# Altium project ADS1282.PrjPcb
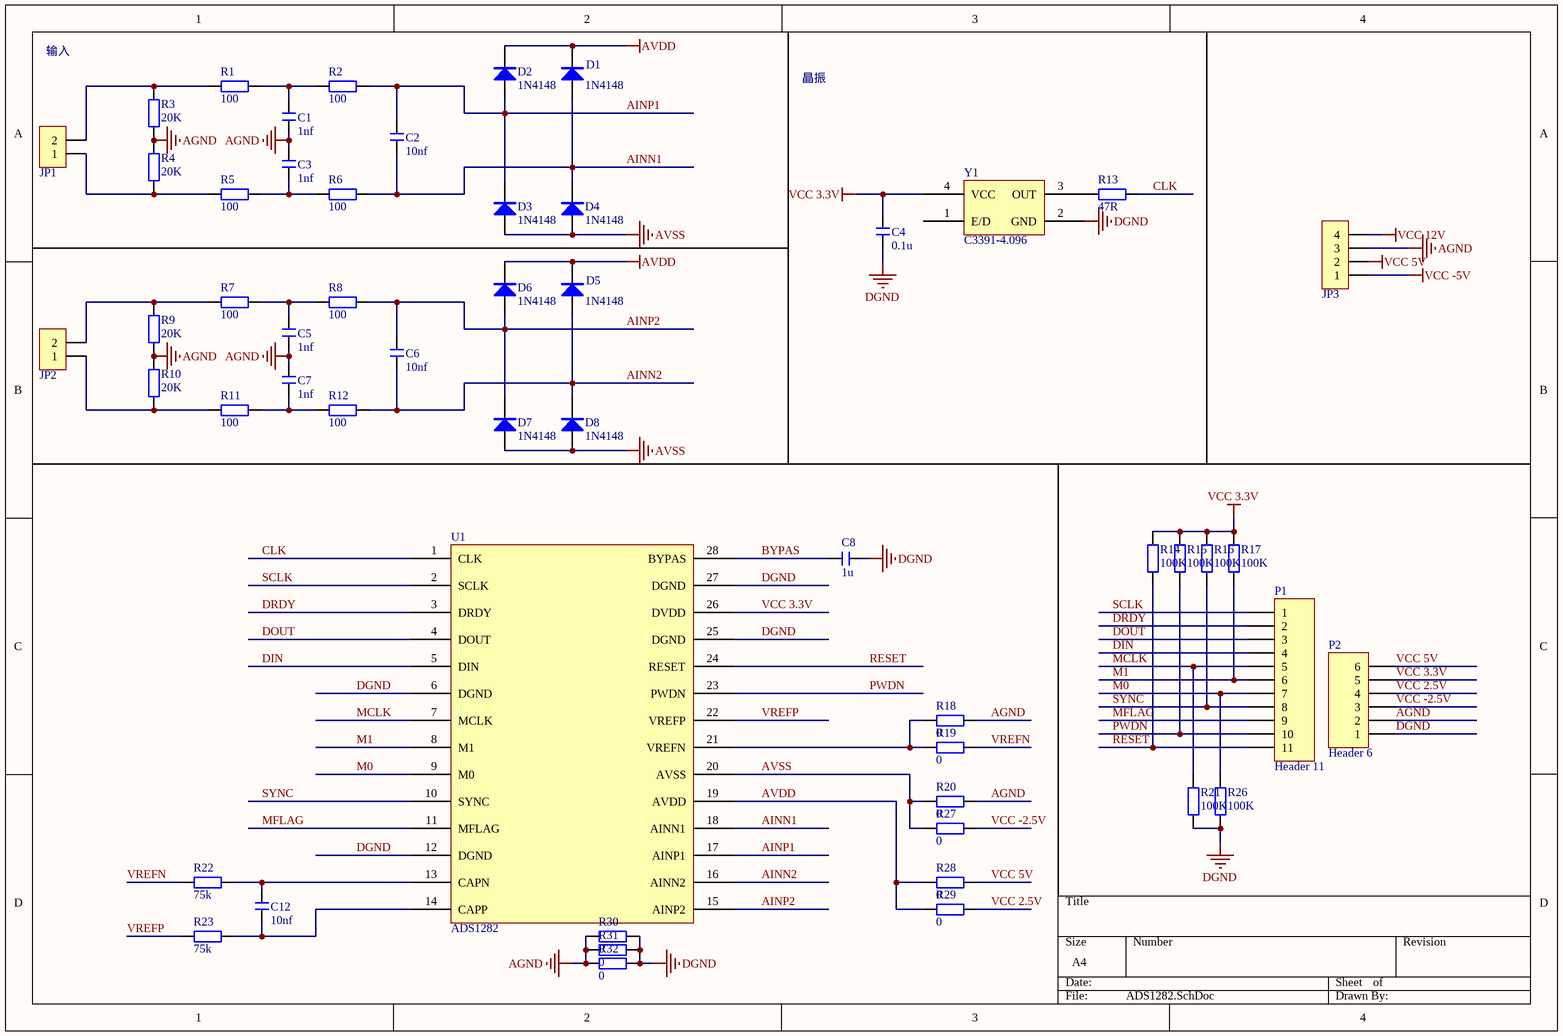
[diagram p0: ADS1282.SchDoc]
2 sheets, 88 parts. Net scope: global (net labels, ports and power ports of the same name join across sheets).
Board file: ADS1282.PcbDoc
Sheets:
  ADS1282.SchDoc
  电源.SchDoc

## Sheet ADS1282.SchDoc
size A4

### Parts
C1  1nf  [C 0805_L]
C2  10nf  [C 0805_L]
C3  1nf  [C 0805_L]
C4  0.1u  [C 0805_L]
C5  1nf  [C 0805_L]
C6  10nf  [C 0805_L]
C7  1nf  [C 0805_L]
C8  1u  [C 0805_L]
C12  10nf  [C 0805_L]
D1  1N4148  [SOD-523]
D2  1N4148  [SOD-523]
D3  1N4148  [SOD-523]
D4  1N4148  [SOD-523]
D5  1N4148  [SOD-523]
D6  1N4148  [SOD-523]
D7  1N4148  [SOD-523]
D8  1N4148  [SOD-523]
JP1  HDR-1X2  [KF2EDGK5.08-LI-2P]  (value not drawn)
JP2  HDR-1X2  [KF2EDGK5.08-LI-2P]  (value not drawn)
JP3  HDR-1X4  [KF2EDGK5.08-LI-4P]  (value not drawn)
P1  Header 11  [HDR1X11]
P2  Header 6  [HDR1X6]
R1  100  [R 0805_L]
R2  100  [R 0805_L]
R3  20K  [R 0805_L]
R4  20K  [R 0805_L]
R5  100  [R 0805_L]
R6  100  [R 0805_L]
R7  100  [R 0805_L]
R8  100  [R 0805_L]
R9  20K  [R 0805_L]
R10  20K  [R 0805_L]
R11  100  [R 0805_L]
R12  100  [R 0805_L]
R13  47R  [R 0805_L]
R14  100K  [R 0805_L]
R15  100K  [R 0805_L]
R16  100K  [R 0805_L]
R17  100K  [R 0805_L]
R18  0  [R 0603_L]
R19  0  [R 0603_L]
R20  0  [R 0603_L]
R21  100K  [R 0805_L]
R22  75k  [R 0805_L]
R23  75k  [R 0805_L]
R26  100K  [R 0805_L]
R27  0  [R 0603_L]
R28  0  [R 0603_L]
R29  0  [R 0603_L]
R30  0  [R 0805_L]
R31  0  [R 0805_L]
R32  0  [R 0805_L]
U1  ADS1282  [SSOP28_N]
Y1  C3391-4.096  [OSC 3225-4P]

### Nets
AGND: C1.1 C3.2 C5.1 C7.2 JP3.3 P2.2 R3.1 R4.2 R9.1 R10.2 R18.2 R20.2 R30.1 R31.1 R32.1
AVDD: D1.2(K) D2.2(K) D5.2(K) D6.2(K) R28.1 R29.1 U1.19(AVDD)
AVSS: D3.1(A) D4.1(A) D7.1(A) D8.1(A) R20.1 R27.1 U1.20(AVSS)
DGND: C4.1 C8.2 P2.1 R21.1 R26.1 R30.2 R31.2 R32.2 U1.6(DGND) U1.12(DGND) U1.25(DGND) U1.27(DGND) Y1.2(GND)
VCC 2.5V: P2.4 R29.2
VCC 3.3V: C4.2 P2.5 R14.2 R15.2 R16.2 R17.2 U1.26(DVDD) Y1.4(VCC)
VCC 5V: JP3.2 P2.6 R28.2
VCC 12V: JP3.4
VCC -2.5V: P2.3 R27.2
VCC -5V: JP3.1
AINN1: C2.1 D1.1(A) D4.2(K) R6.2 U1.18(AINN1)
AINN2: C6.1 D5.1(A) D8.2(K) R12.2 U1.16(AINN2)
AINP1: C2.2 D2.1(A) D3.2(K) R2.2 U1.17(AINP1)
AINP2: C6.2 D6.1(A) D7.2(K) R8.2 U1.15(AINP2)
BYPAS: C8.1 U1.28(BYPAS)
CLK: R13.2 U1.1(CLK)
DIN: P1.4 U1.5(DIN)
DOUT: P1.3 U1.4(DOUT)
DRDY: P1.2 U1.3(DRDY)
M0: P1.7 R26.2 U1.9(M0)
M1: P1.6 R17.1 U1.8(M1)
MCLK: P1.5 R21.2 U1.7(MCLK)
MFLAG: P1.9 U1.11(MFLAG)
PWDN: P1.10 R15.1 U1.23(PWDN)
RESET: P1.11 R14.1 U1.24(RESET)
SCLK: P1.1 U1.2(SCLK)
SYNC: P1.8 R16.1 U1.10(SYNC)
VREFN: R19.2 R22.1
VREFP: R23.1 U1.22(VREFP)
NetC1_2: C1.2 R1.2 R2.1
NetC3_1: C3.1 R5.2 R6.1
NetC5_2: C5.2 R7.2 R8.1
NetC7_1: C7.1 R11.2 R12.1
NetC12_1: C12.1 R23.2 U1.14(CAPP)
NetC12_2: C12.2 R22.2 U1.13(CAPN)
NetJP1_1: JP1.1 R4.1 R5.1
NetJP1_2: JP1.2 R1.1 R3.2
NetJP2_1: JP2.1 R10.1 R11.1
NetJP2_2: JP2.2 R7.1 R9.2
NetR13_1: R13.1 Y1.3(OUT)
NetR18_1: R18.1 R19.1 U1.21(VREFN)

Not connected (* = marked no-connect by the designer): Y1 1(E/D)

### Notes on the sheet
- 输入
- 晶振

### Library data of the parts
C1-C8 C12 = C: 无极性贴片电容; 版权归属: 源创客; BOM名称: 无极性贴片电容; 学习资源: www.ooocke.com
D1-D8 = 1N4148: 高速开关二极管; 版权归属: 源创客; BOM名称: 高速开关二极管; 学习资源: www.ooocke.com
JP1 JP2 = Header 2: 2P接插件; 版权归属: 源创客; BOM名称: 2P接插件; 学习资源: www.ooocke.com
JP3 = Header 4: 4P接插件; 版权归属: 源创客; BOM名称: 4P接插件; 学习资源: www.ooocke.com
P1 = Header 11: Header, 11-Pin; LatestRevisionDate: 17-Jul-2002; LatestRevisionNote: Re-released for DXP Platform.; Publisher: Altium Limited
P2 = Header 6: Header, 6-Pin; LatestRevisionDate: 17-Jul-2002; LatestRevisionNote: Re-released for DXP Platform.; Publisher: Altium Limited
R1-R23 R26-R32 = R: 贴片电阻; 版权归属: 源创客; BOM名称: 贴片电阻; 学习资源: www.ooocke.com
Y1 = 4.096M

## Sheet 电源.SchDoc
size A4
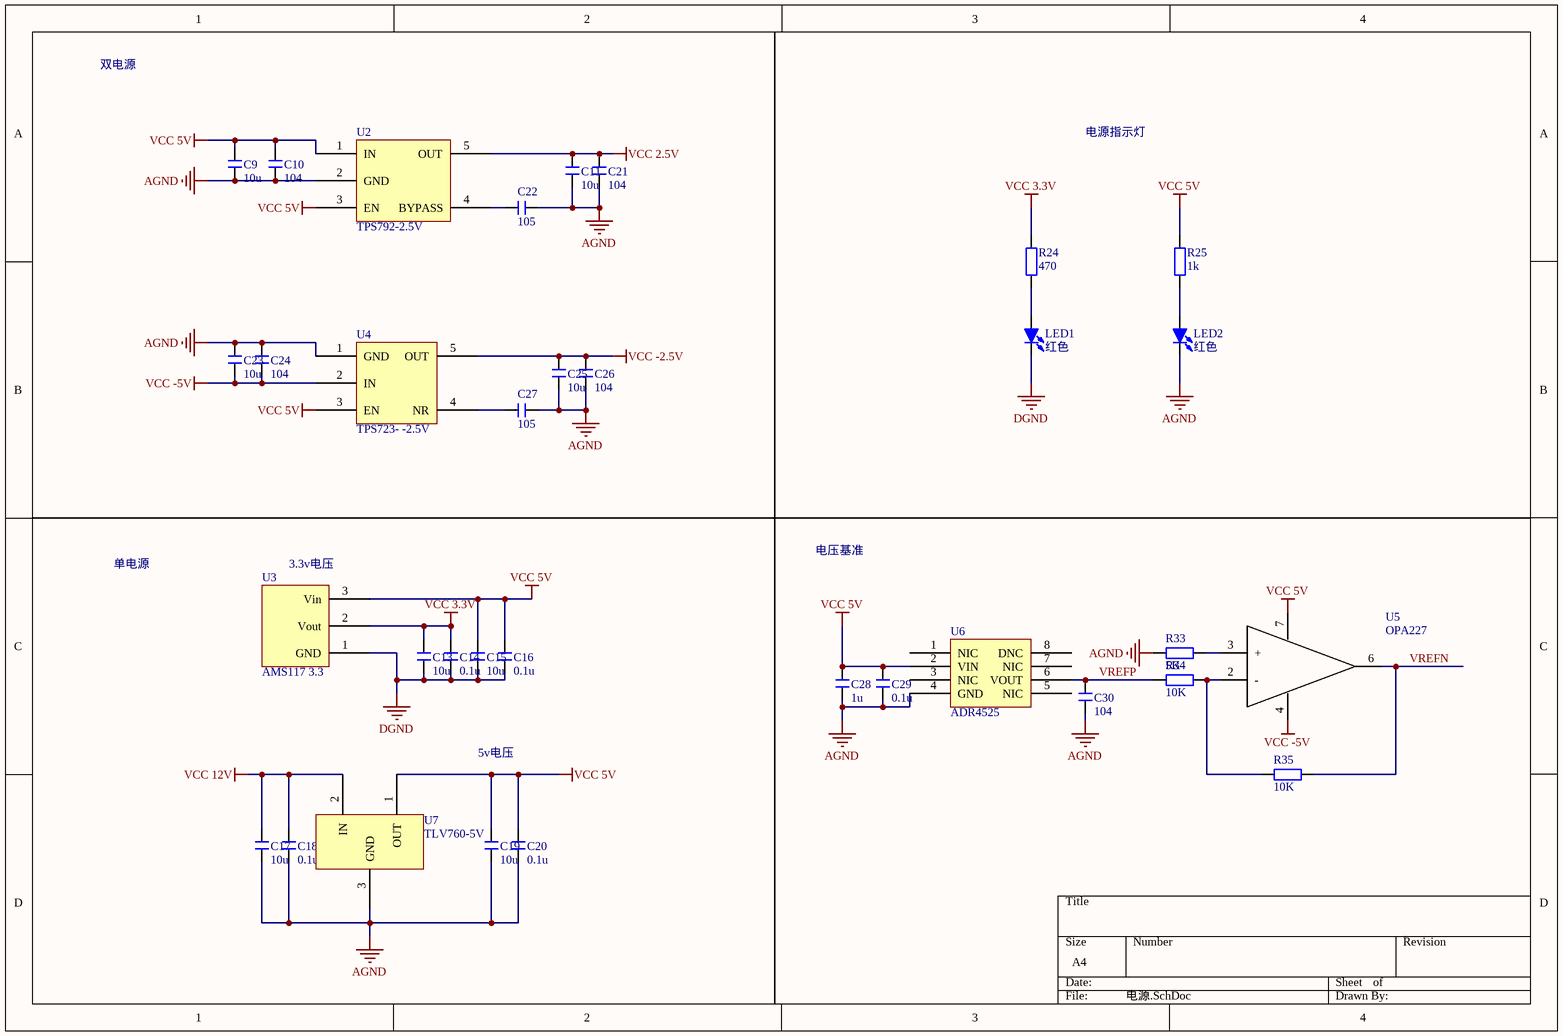
[diagram p1: 电源.SchDoc]

### Parts
C9  10u  [C 0805_L]
C10  104  [C 0805_L]
C11  10u  [C 0805_L]
C13  10u  [C 0805_L]
C14  0.1u  [C 0805_L]
C15  10u  [C 0805_L]
C16  0.1u  [C 0805_L]
C17  10u  [C 0805_L]
C18  0.1u  [C 0805_L]
C19  10u  [C 0805_L]
C20  0.1u  [C 0805_L]
C21  104  [C 0805_L]
C22  105  [C 0805_L]
C23  10u  [C 0805_L]
C24  104  [C 0805_L]
C25  10u  [C 0805_L]
C26  104  [C 0805_L]
C27  105  [C 0805_L]
C28  1u  [C 0805_L]
C29  0.1u  [C 0805_L]
C30  104  [C 0805_L]
LED1  红色  [LED 0805G]
LED2  红色  [LED 0805G]
R24  470  [R 0805_L]
R25  1k  [R 0805_L]
R33  5K  [R 0805_L]
R34  10K  [R 0805_L]
R35  10K  [R 0805_L]
U2  TPS792-2.5V  [SOT23-5N]
U3  AMS117 3.3  [SOT223_N]
U4  TPS723- -2.5V  [SOT23-5N]
U5  OPA227  [SOP8_N]
U6  ADR4525  [SOP8_N]
U7  TLV760-5V  [SOT23-3N]

### Nets
AGND: C9.1 C10.1 C11.1 C17.1 C18.1 C19.1 C20.1 C21.1 C22.2 C23.2 C24.2 C25.1 C26.1 C27.2 C28.1 C29.1 C30.1 LED2.2(K) R33.2 U2.2(GND) U4.1(GND) U6.4(GND) U7.3(GND)
DGND: C13.1 C14.1 C15.1 C16.1 LED1.2(K) U3.1(GND)
VCC 2.5V: C11.2 C21.2 U2.5(OUT)
VCC 3.3V: C13.2 C14.2 R24.2 U3.2(Vout)
VCC 5V: C9.2 C10.2 C15.2 C16.2 C19.2 C20.2 C28.2 C29.2 R25.2 U2.1(IN) U2.3(EN) U3.3(Vin) U4.3(EN) U5.7(VCC) U6.2(VIN) U7.1(OUT)
VCC 12V: C17.2 C18.2 U7.2(IN)
VCC -2.5V: C25.2 C26.2 U4.5(OUT)
VCC -5V: C23.1 C24.1 U4.2(IN) U5.4(VSS)
VREFN: R35.2 U5.6(UOT)
VREFP: C30.2 R34.1 U6.6(VOUT)
NetC22_1: C22.1 U2.4(BYPASS)
NetC27_1: C27.1 U4.4(NR)
NetLED1_1: LED1.1(A) R24.1
NetLED2_1: LED2.1(A) R25.1
NetR33_1: R33.1 U5.3(+)
NetR34_2: R34.2 R35.1 U5.2(-)

Not connected (* = marked no-connect by the designer): U6 1(NIC) 3(NIC) 5(NIC) 7(NIC) 8(DNC)

### Notes on the sheet
- 双电源
- 电源指示灯
- 单电源
- (near U3) 3.3v电压
- 电压基准
- 5v电压

### Library data of the parts
C9-C11 C13-C30 = C: 无极性贴片电容; 版权归属: 源创客; BOM名称: 无极性贴片电容; 学习资源: www.ooocke.com
LED1 LED2 = LED-SMD: 贴片LED; 版权归属: 源创客; BOM名称: 贴片LED; 学习资源: www.ooocke.com
R24 R25 R33-R35 = R: 贴片电阻; 版权归属: 源创客; BOM名称: 贴片电阻; 学习资源: www.ooocke.com
U3 = AMS117
U4 = TPS723-  -2.5V
U5 = OP27
U6 = ADR45
U7 = TLV760

## Nets that join several sheets
AGND: ADS1282 (15 pins), 电源 (23 pins)
DGND: ADS1282 (13 pins), 电源 (6 pins)
VCC 2.5V: ADS1282 (P2.4 R29.2), 电源 (C11.2 C21.2 U2.5)
VCC 3.3V: ADS1282 (8 pins), 电源 (C13.2 C14.2 R24.2 U3.2)
VCC 5V: ADS1282 (JP3.2 P2.6 R28.2), 电源 (16 pins)
VCC 12V: ADS1282 (JP3.4), 电源 (C17.2 C18.2 U7.2)
VCC -2.5V: ADS1282 (P2.3 R27.2), 电源 (C25.2 C26.2 U4.5)
VCC -5V: ADS1282 (JP3.1), 电源 (C23.1 C24.1 U4.2 U5.4)
VREFN: ADS1282 (R19.2 R22.1), 电源 (R35.2 U5.6)
VREFP: ADS1282 (R23.1 U1.22), 电源 (C30.2 R34.1 U6.6)